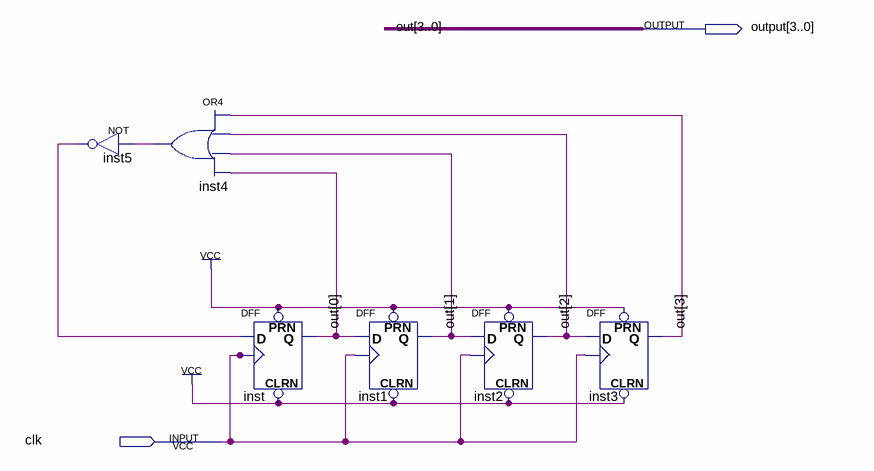
[diagram p0: schematic sheet]
// Quartus schematic shiftreg.bdf as structural Verilog: 6 symbols, 2 pins
module shiftreg (
  input  clk,
  output [3:0] \output 
);

  wire inst4_out, inst5_out;

  not inst5 (inst5_out, inst4_out);
  or inst4 (inst4_out, \output [3], \output [2], \output [1], \output [0]);
  DFF inst (.CLRN(1'b1), .CLK(clk), .D(inst5_out), .PRN(1'b1), .Q(\output [0]));
  DFF inst1 (.CLRN(1'b1), .CLK(clk), .D(\output [0]), .PRN(1'b1), .Q(\output [1]));
  DFF inst2 (.CLRN(1'b1), .CLK(clk), .D(\output [1]), .PRN(1'b1), .Q(\output [2]));
  DFF inst3 (.CLRN(1'b1), .CLK(clk), .D(\output [2]), .PRN(1'b1), .Q(\output [3]));

  // Other names for the same wires on the sheet: out[3:0] = \output 
endmodule
